# EAGLE design LPEM (EAGLE 9.4.1)

## Sheet 1 of 2
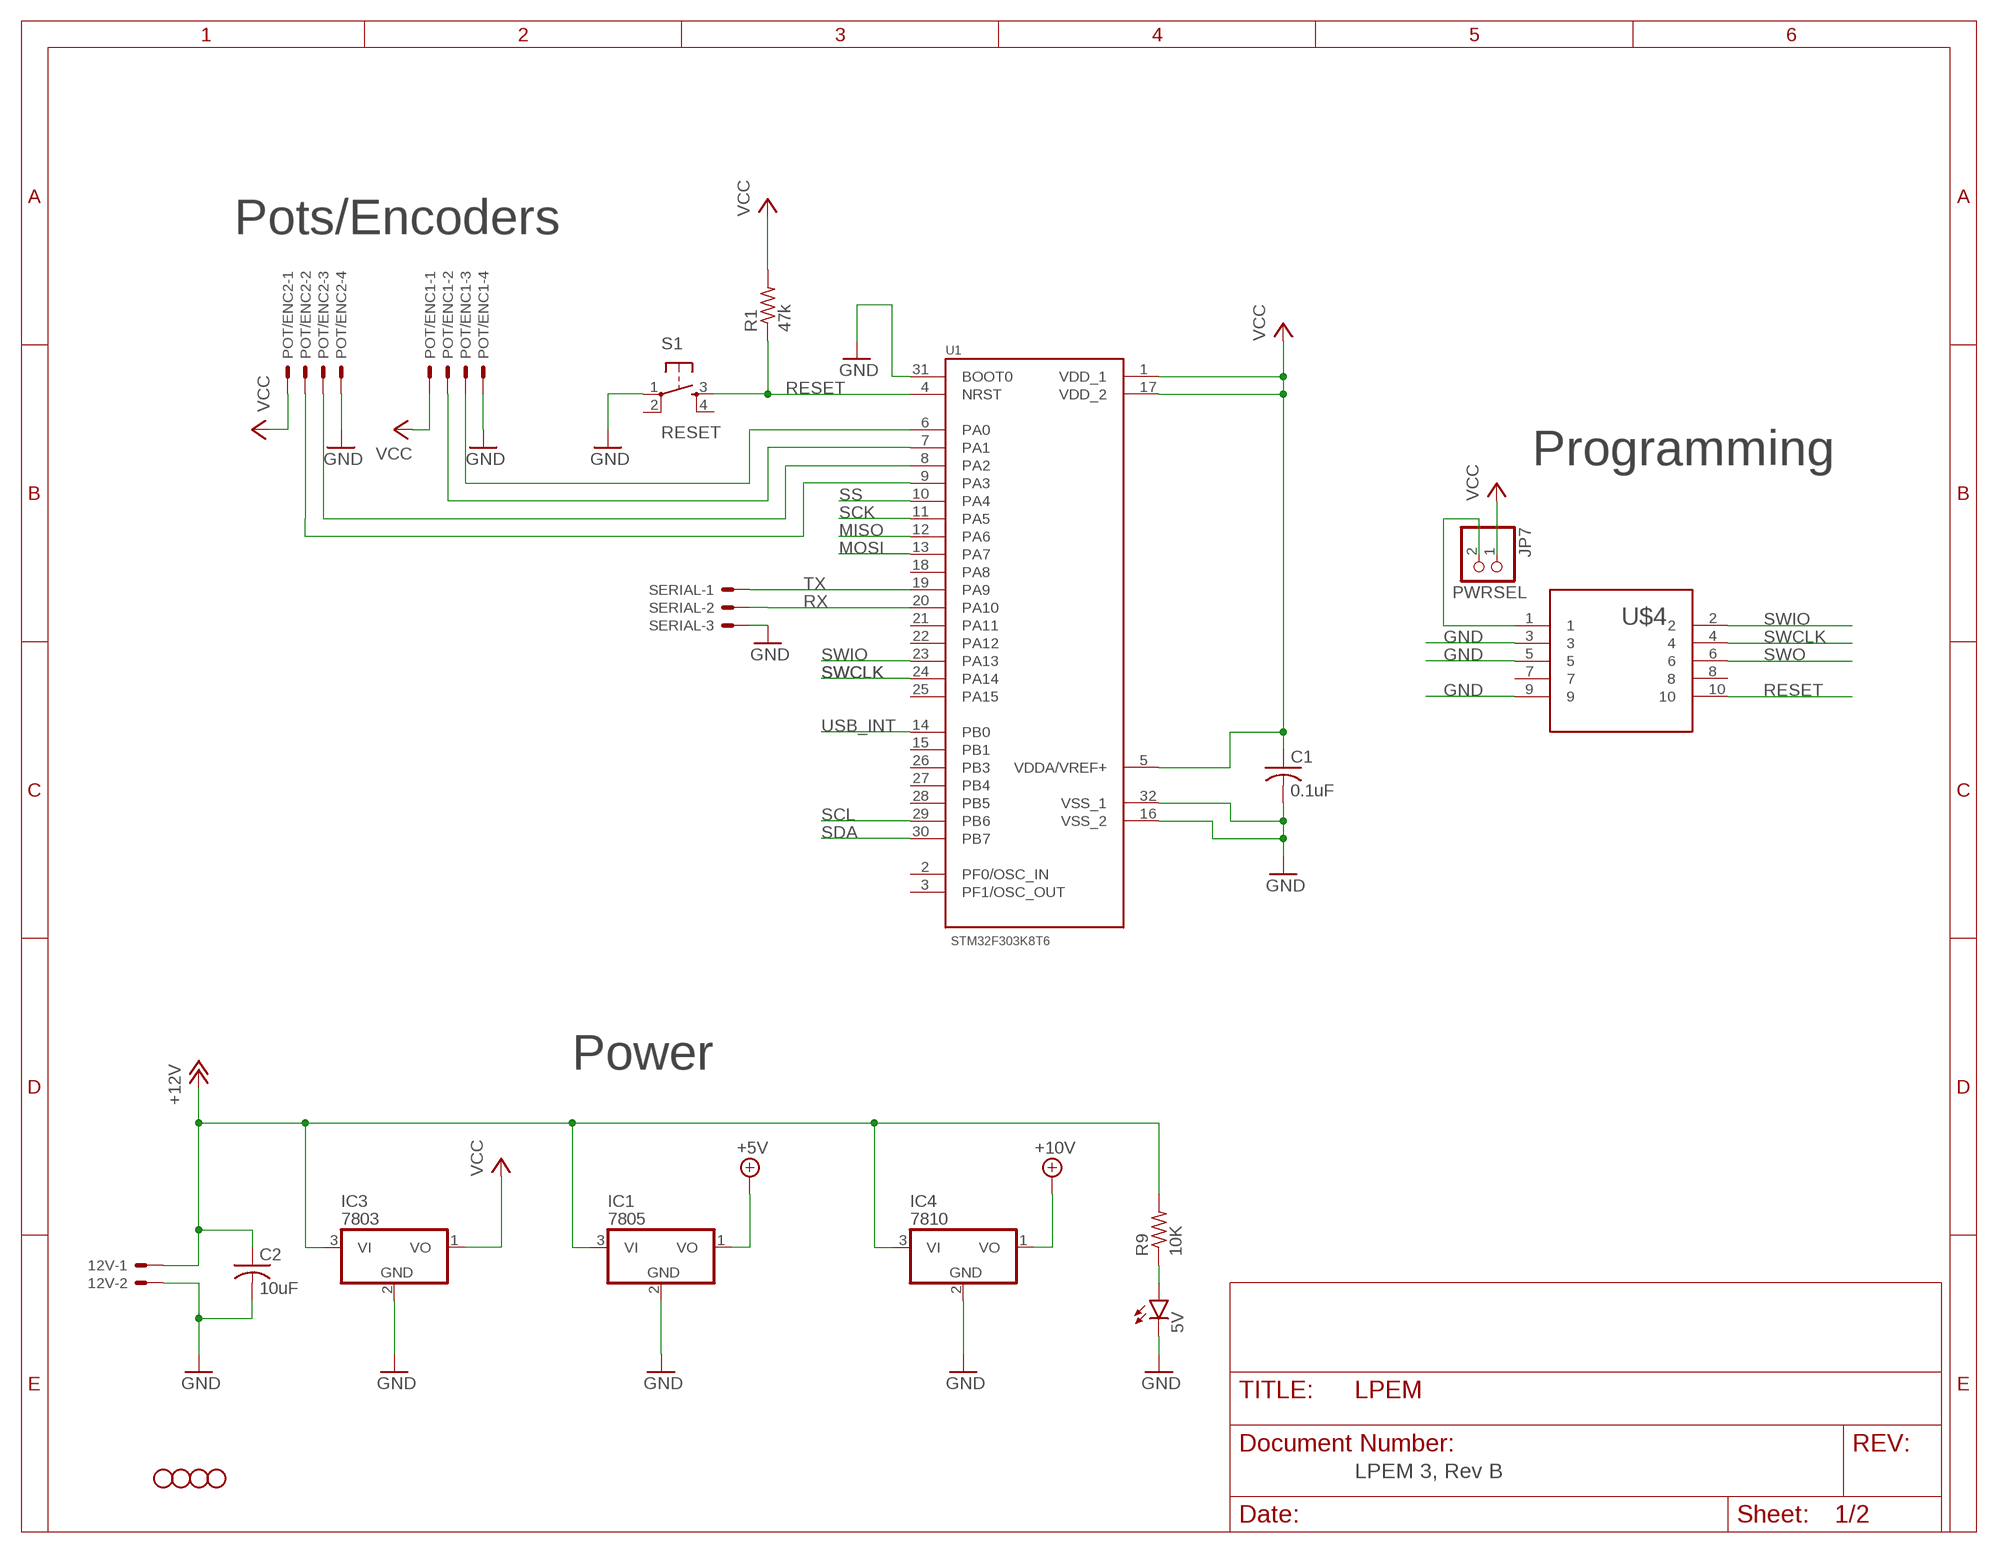
[diagram p0: schematic, sheet 1]

### Parts
5V  LED3MM  [LED3MM]
12V  22-23-2021  [22-23-2021]
C1  0.1uF  C-US025-025X050  [C025-025X050]
C2  10uF  C-US025-025X050  [C025-025X050]
IC1  7805  78L05Z  [TO92]
IC3  7803  78L05Z  [TO92]
IC4  7810  78L05Z  [TO92]
JP1  STAND-OFF  [STAND-OFF]
JP2  STAND-OFF  [STAND-OFF]
JP7  PWRSEL  PINHD-1X2  [1X02]
JP8  STAND-OFF  [STAND-OFF]
JP9  STAND-OFF  [STAND-OFF]
POT/ENC1  22-23-2041  [22-23-2041]
POT/ENC2  22-23-2041  [22-23-2041]
R1  47k  R-US_0204/5  [0204/5]
R9  10K  R-US_0204/5  [0204/5]
S1  RESET  TAC_SWITCHPTH  [TACTILE-PTH]
SERIAL  22-23-2031  [22-23-2031]
U1  STM32F303K8T6  [QFP80P900X900X160-32N]
U$4  CORTEX_HEADERJ  [CORTEX_HEADER]

### Nets
+5V [power]: IC1.1(VO) ; also sheet 2
+10V [power]: IC4.1(VO) ; also sheet 2
+12V [power]: 12V.1 C2.1 IC1.3(VI) IC3.3(VI) IC4.3(VI) R9.2 ; also sheet 2
GND [power]: 5V.K(C) 12V.2 C1.2 C2.2 IC1.2(GND) IC3.2(GND) IC4.2(GND) POT/ENC1.4 POT/ENC2.4 S1.1 SERIAL.3 U1.16(VSS_2) U1.31(BOOT0) U1.32(VSS_1) U$4.3 U$4.5 U$4.9 ; also sheet 2
MISO: U1.12(PA6) ; also sheet 2
MOSI: U1.13(PA7) ; also sheet 2
N$1: POT/ENC2.3 U1.8(PA2)
N$2: POT/ENC2.2 U1.9(PA3)
N$3: POT/ENC1.3 U1.6(PA0)
N$4 [power]: JP7.2 U$4.1
N$5: 5V.A R9.1
N$6: POT/ENC1.2 U1.7(PA1)
RESET: R1.1 S1.3 U1.4(NRST) U$4.10
RX: SERIAL.2 U1.20(PA10)
SCK: U1.11(PA5) ; also sheet 2
SCL: U1.29(PB6) ; also sheet 2
SDA: U1.30(PB7) ; also sheet 2
SS: U1.10(PA4) ; also sheet 2
SWCLK: U1.24(PA14) U$4.4
SWIO: U1.23(PA13) U$4.2
SWO: U$4.6
TX: SERIAL.1 U1.19(PA9)
USB_INT: U1.14(PB0) ; also sheet 2
VCC [power]: C1.1 IC3.1(VO) JP7.1 POT/ENC1.1 POT/ENC2.1 R1.2 U1.1(VDD_1) U1.5(VDDA/VREF+) U1.17(VDD_2) ; also sheet 2
Unconnected: S1.2 S1.4 U1.2(PF0/OSC_IN) U1.3(PF1/OSC_OUT) U1.15(PB1) U1.18(PA8) U1.21(PA11) U1.22(PA12) U1.25(PA15) U1.26(PB3) U1.27(PB4) U1.28(PB5) U$4.7 U$4.8

### Notes on the sheet
- Pots/Encoders
- Programming
- Power
- LPEM 3, Rev B

## Sheet 2 of 2
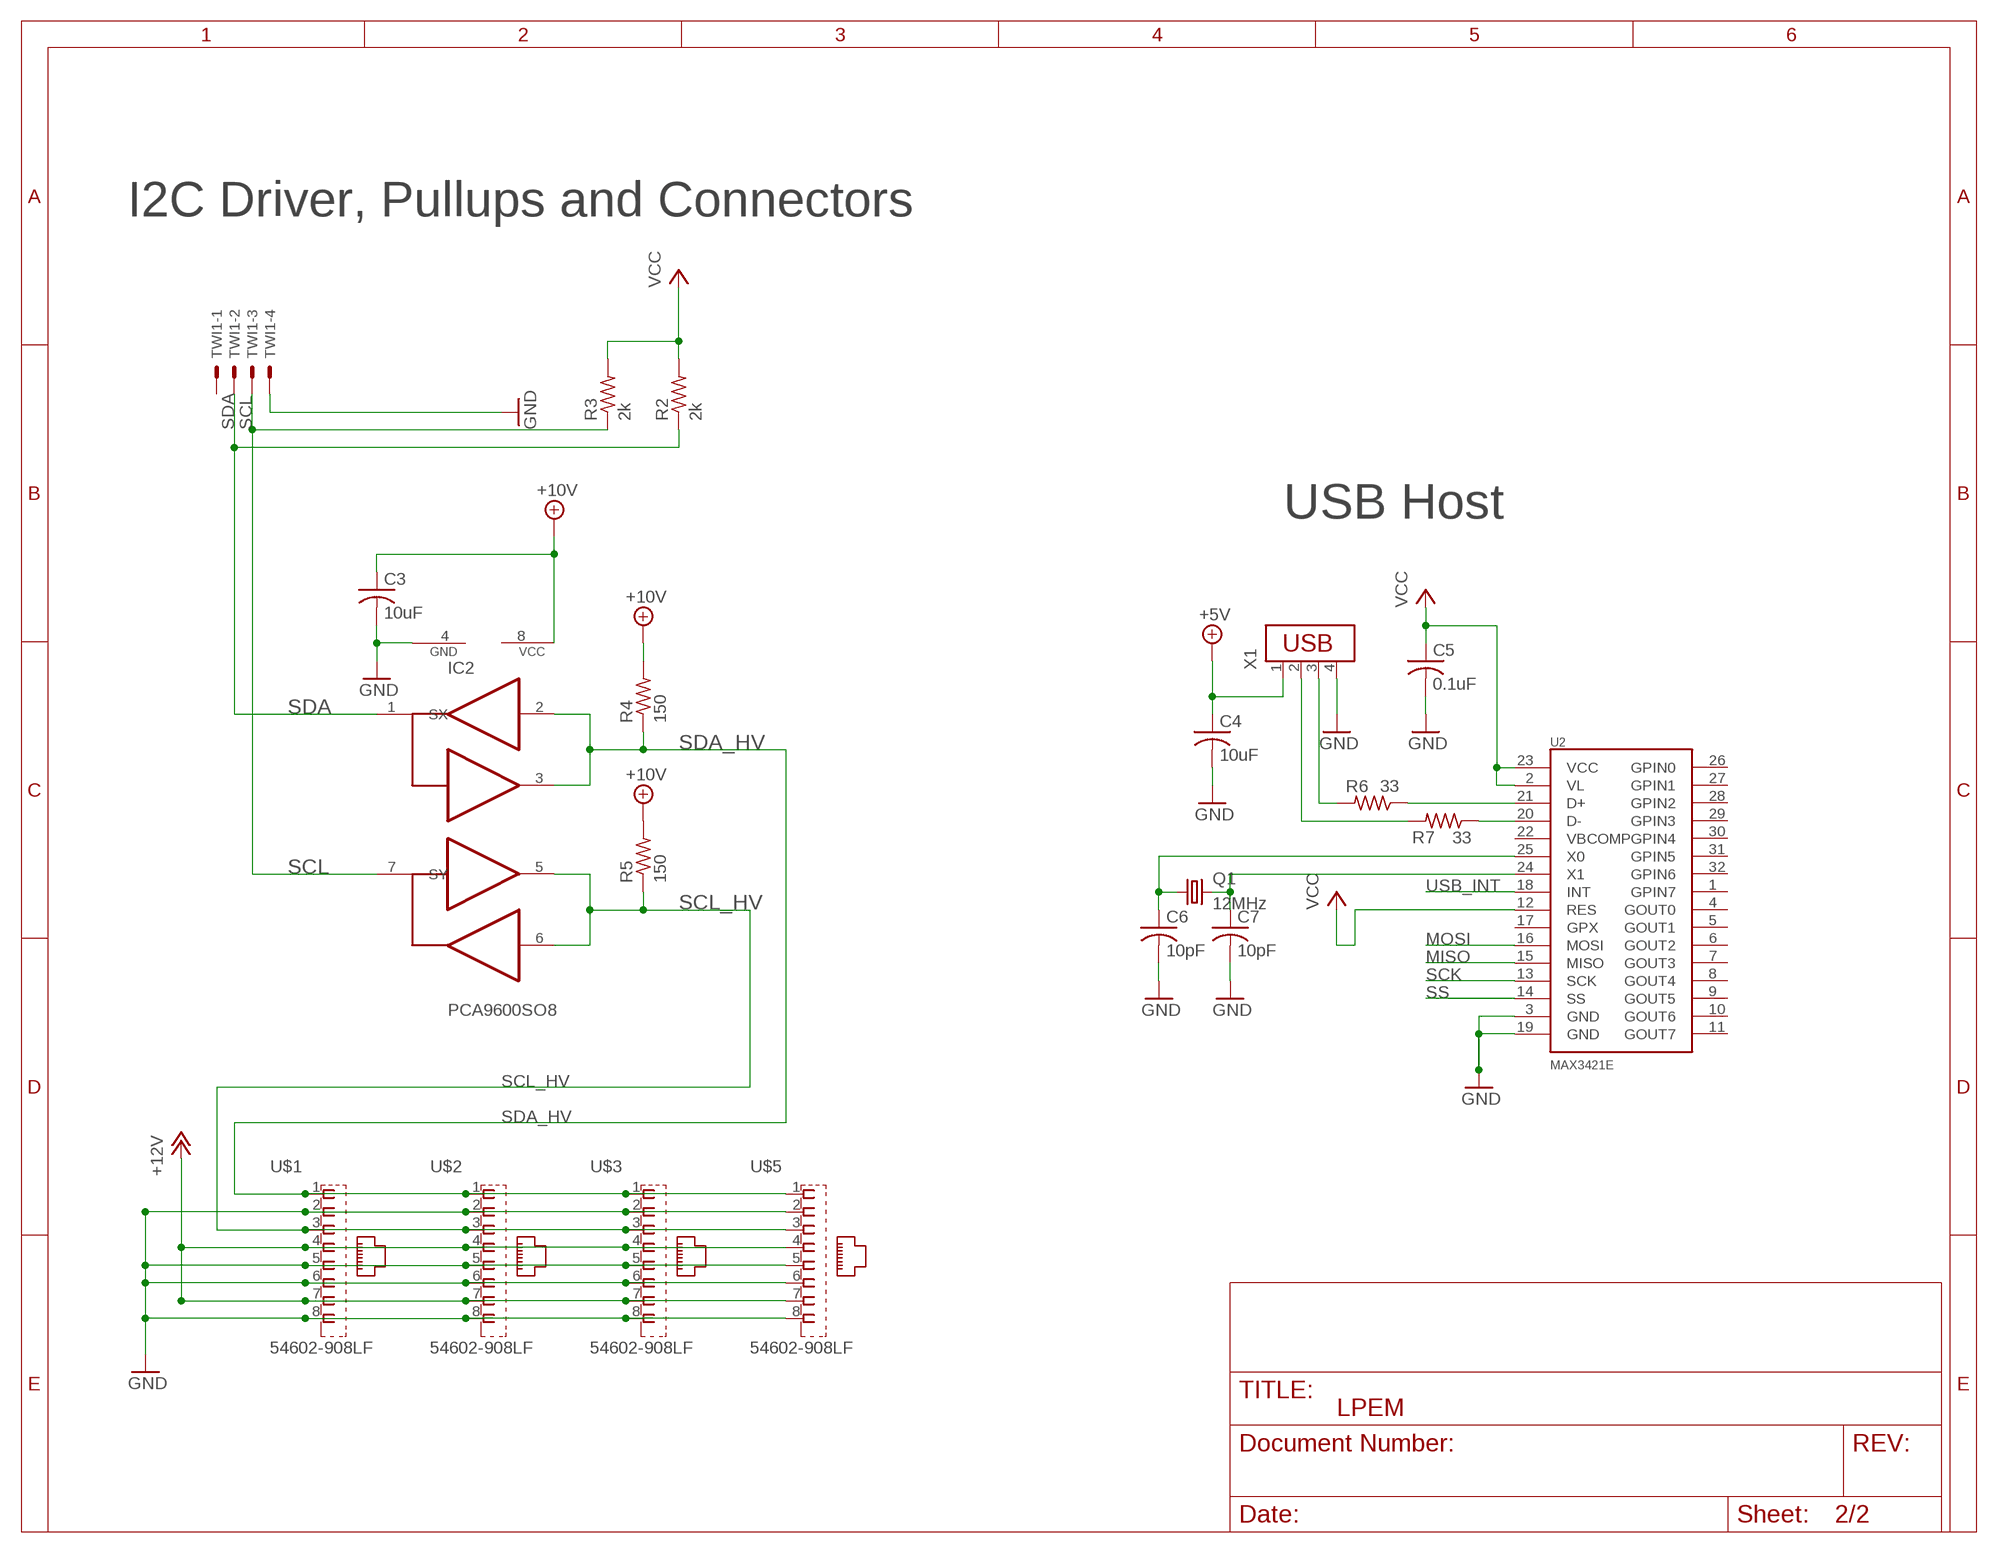
[diagram p1: schematic, sheet 2]

### Parts
C3  10uF  C-US025-025X050  [C025-025X050]
C4  10uF  C-US025-025X050  [C025-025X050]
C5  0.1uF  C-US025-025X050  [C025-025X050]
C6  10pF  C-US025-025X050  [C025-025X050]
C7  10pF  C-US025-025X050  [C025-025X050]
IC2  PCA9600SO8  [SO08]
Q1  12MHz  CRYSTALHC18U-V  [HC18U-V]
R2  2k  R-US_0204/5  [0204/5]
R3  2k  R-US_0204/5  [0204/5]
R4  150  R-US_0204/5  [0204/5]
R5  150  R-US_0204/5  [0204/5]
R6  33  R-US_0204/5  [0204/5]
R7  33  R-US_0204/5  [0204/5]
TWI1  22-23-2041  [22-23-2041]
U2  MAX3421E  [TQFP32-5MM]
U$1  54602-908LF  [AMPHENOL_54602-908LF]
U$2  54602-908LF  [AMPHENOL_54602-908LF]
U$3  54602-908LF  [AMPHENOL_54602-908LF]
U$5  54602-908LF  [AMPHENOL_54602-908LF]
X1  USB-787616  [USB]

### Nets
+5V [power]: C4.1 X1.1 ; also sheet 1
+10V [power]: C3.1 IC2.8(VCC) R4.2 R5.2 ; also sheet 1
+12V [power]: U$1.4 U$1.7 U$2.4 U$2.7 U$3.4 U$3.7 U$5.4 U$5.7 ; also sheet 1
GND [power]: C3.2 C4.2 C5.2 C6.2 C7.2 IC2.4(GND) TWI1.4 U2.3(GND) U2.19(GND) U$1.2 U$1.5 U$1.6 U$1.8 U$2.2 U$2.5 U$2.6 U$2.8 U$3.2 U$3.5 U$3.6 U$3.8 U$5.2 U$5.5 U$5.6 U$5.8 X1.4 ; also sheet 1
MISO: U2.15(MISO) ; also sheet 1
MOSI: U2.16(MOSI) ; also sheet 1
N$7: R6.2 X1.3
N$8: R7.2 X1.2
N$9: C6.1 Q1.1 U2.25(X0)
N$10: C7.1 Q1.2 U2.24(X1)
N$11: R6.1 U2.21(D+)
N$12: R7.1 U2.20(D-)
SCK: U2.13(SCK) ; also sheet 1
SCL: IC2.7(SY) R3.1 TWI1.3 ; also sheet 1
SCL_HV: IC2.5(TY) IC2.6(RY) R5.1 U$1.3 U$2.3 U$3.3 U$5.3
SDA: IC2.1(SX) R2.1 TWI1.2 ; also sheet 1
SDA_HV: IC2.2(RX) IC2.3(TX) R4.1 U$1.1 U$2.1 U$3.1 U$5.1
SS: U2.14(SS) ; also sheet 1
USB_INT: U2.18(INT) ; also sheet 1
VCC [power]: C5.1 R2.2 R3.2 U2.2(VL) U2.12(RES) U2.23(VCC) ; also sheet 1
Unconnected: TWI1.1 U2.1(GPIN7) U2.4(GOUT0) U2.5(GOUT1) U2.6(GOUT2) U2.7(GOUT3) U2.8(GOUT4) U2.9(GOUT5) U2.10(GOUT6) U2.11(GOUT7) U2.17(GPX) U2.22(VBCOMP) U2.26(GPIN0) U2.27(GPIN1) U2.28(GPIN2) U2.29(GPIN3) U2.30(GPIN4) U2.31(GPIN5) U2.32(GPIN6)

### Notes on the sheet
- I2C Driver, Pullups and Connectors
- USB Host

## Library data of the parts
5V = led:LED: LED OSRAM: - CHIPLED LG R971, LG N971, LY N971, LG Q971, LY Q971, LO R971, LY R971 LH N974, LH R974 LS Q976, LO Q976, LY Q976 LO Q996 - Hyper CHIPLED LW Q18S LB Q993, LB Q99A, LB R99A - SideLED LS A670, LO A670, LY A670, LG A670, LP A670 LB A673, LV A673, LT A673, LW A673 LH A674 LY A675 LS A676, LA A676, LO A676, LY A676, LW A676 LS A679, LY A679, LG A679 - Hyper Micro SIDELED® LS Y876, LA Y876, LO Y876, LY Y876 LT Y87S - SmartLED LW L88C, LW L88S LB L89C, LB L89S, LG L890 LS L89K, LO L89K, LY L89K LS L896, LA L896, LO L896, LY L896 - TOPLED LS T670, LO T670, LY T670, LG T670, LP T670 LSG T670, LSP T670, LSY T670, LOP T670, LYG T670 LG T671, LOG T671, LSG T671 LB T673, LV T673, LT T673, LW T673 LH T674 LS T676, LA T676, LO T676, LY T676, LB T676, LH T676, LSB T676, LW T676 LB T67C, LV T67C, LT T67C, LS T67K, LO T67K, LY T67K, LW E67C LS E67B, LA E67B, LO E67B, LY E67B, LB E67C, LV E67C, LT E67C LW T67C LS T679, LY T679, LG T679 LS T770, LO T770, LY T770, LG T770, LP T770 LB T773, LV T773, LT T773, LW T773 LH T774 LS E675, LA E675, LY E675, LS T675 LS T776, LA T776, LO T776, LY T776, LB T776 LHGB T686 LT T68C, LB T68C - Hyper Mini TOPLED® LB M676 - Mini TOPLED Santana® LG M470 LS M47K, LO M47K, LY M47K Source: http://www.osram.convergy.de LUXEON: - LUMILED® LXK2-PW12-R00, LXK2-PW12-S00, LXK2-PW14-U00, LXK2-PW14-V00 LXK2-PM12-R00, LXK2-PM12-S00, LXK2-PM14-U00 LXK2-PE12-Q00, LXK2-PE12-R00, LXK2-PE12-S00, LXK2-PE14-T00, LXK2-PE14-U00 LXK2-PB12-K00, LXK2-PB12-L00, LXK2-PB12-M00, LXK2-PB14-N00, LXK2-PB14-P00, LXK2-PB14-Q00 LXK2-PR12-L00, LXK2-PR12-M00, LXK2-PR14-Q00, LXK2-PR14-R00 LXK2-PD12-Q00, LXK2-PD12-R00, LXK2-PD12-S00 LXK2-PH12-R00, LXK2-PH12-S00 LXK2-PL12-P00, LXK2-PL12-Q00, LXK2-PL12-R00 Source: www.luxeon.com KINGBRIGHT: KA-3528ASYC Source: www.kingbright.com
12V = con-molex:22-23-2021: .100" (2.54mm) Center Header - 2 Pin; MF: MOLEX; MPN: 22-23-2021; OC_FARNELL: 1462926; OC_NEWARK: 25C3832
C1-C7 = rcl:C-US: CAPACITOR, American symbol; SPICEPREFIX: C
IC1 IC3 IC4 = linear:78*: Positive VOLTAGE REGULATOR Source: http://cache.national.com/ds/LM/LM78L05.pdf http://www.fairchildsemi.com/ds/LM/LM7805.pdf
IC2 = 4534_I2C2:PCA9600: I2C ACTIVE TERMINATOR SO-8
JP1 JP2 JP8 JP9 = SparkFun:STAND-OFF: Stand Off This is the mechanical footprint for a #4 phillips button head screw. Use the keepout ring to avoid running the screw head into surrounding components. SKU : PRT-00447
JP7 = pinhead:PINHD-1X2: PIN HEADER
POT/ENC1 POT/ENC2 TWI1 = con-molex:22-23-2041: .100" (2.54mm) Center Header - 4 Pin; MF: MOLEX; MPN: 22-23-2041; OC_FARNELL: 1462920; OC_NEWARK: 38C0355
Q1 = crystal:CRYSTAL: CRYSTAL; OC_FARNELL: unknown; OC_NEWARK: unknown
R1-R7 R9 = rcl:R-US_: RESISTOR, American symbol; SPICEPREFIX: R
S1 = SparkFun:TAC_SWITCH: Momentary Switch Button commonly used for reset or general input. Spark Fun Electronics SKU : COM-00097
SERIAL = con-molex:22-23-2031: .100" (2.54mm) Center Header - 3 Pin; MF: MOLEX; MPN: 22-23-2031; OC_FARNELL: 1462950; OC_NEWARK: 30C0862
U1 = STM32F303K8T6:STM32F303K8T6: Analog and DSP with FPU ARM Cortex-M4 MCU with 64 Kbytes Flash, 72 MHz CPU, CCM, 12-bit ADC 5 MSPS, comparators, op-amp; AVAILABILITY: Unavailable; DESCRIPTION: Analog and DSP with FPU ARM Cortex-M4 MCU with 64 Kbytes Flash, 72 MHz CPU, CCM, 12-bit ADC 5 MSPS, comparators, op-amp; MF: STMicroelectronics; MP: STM32F303K8T6; PACKAGE: LQFP-32 STMicroelectronics; PRICE: None
U2 = MAX3421E:MAX3421E: USB Peripheral/Host Controller with SPI Interface.; AVAILABILITY: Unavailable; DESCRIPTION: 1.2v To +5.5v, ±15kv Esd-Protected, 0.1µa, 35mbps, 8-Channel Level Translators; MF: Maxim Integrated; MP: MAX3421E; PACKAGE: None; PRICE: None
U$1-U$3 U$5 = 54602-908LF:54602-908LF: CONN MOD JACK 8P8C R/A UNSHLD; DESCRIPTION: Cat3 Rj45 Modular Jack, 8 Position, 1 Port; DIGI-KEY_PART_NUMBER: 609-1046-ND; DIGI-KEY_PURCHASE_URL: https://www.digikey.com/product-detail/en/amphenol-icc-fci/54602-908LF/609-1046-ND/1001360?utm_source=snapeda&utm_medium=aggregator&utm_campaign=symbol; MF: Amphenol ICC; MP: 54602-908LF; PACKAGE: None
U$4 = Lectrobox:CORTEX_HEADER; AVAILABILITY: Unavailable; DESCRIPTION: Conn Shrouded Header HDR 10 POS 1.27mm Solder ST Thru-Hole Tube; MF: Samtec Inc.; MP: TFM-105-01-S-D-WT; PACKAGE: None; PRICE: None
X1 = con-amp:USB-787616: AMP connector

## Net classes
0 default: width 0.152 mm, drill 0.152 mm, clearance 0.152 mm
1 power: width 0.305 mm, drill 0.305 mm, clearance 0.152 mm to class 0, clearance 0.152 mm

## Board
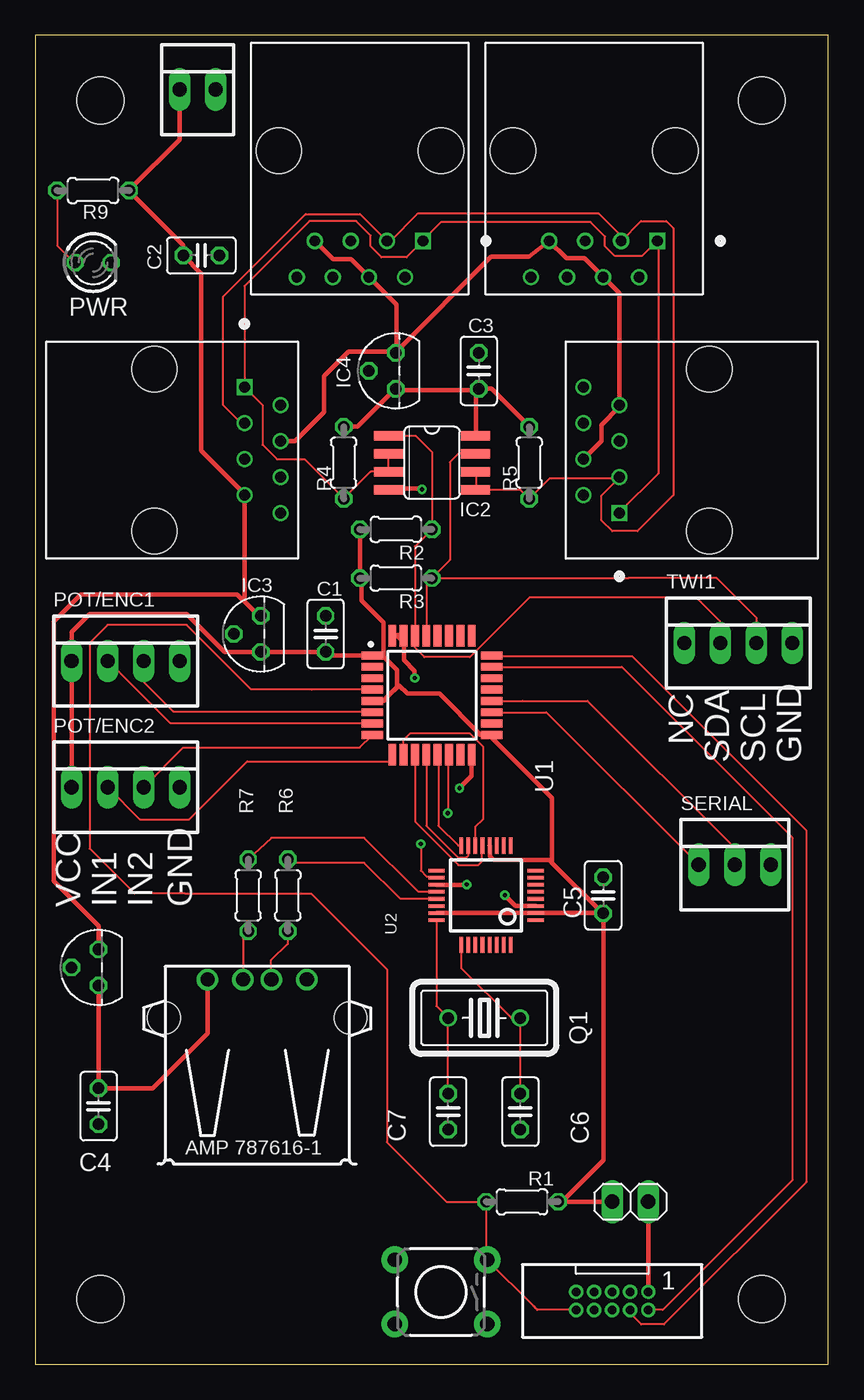
[diagram p2: board, top side]
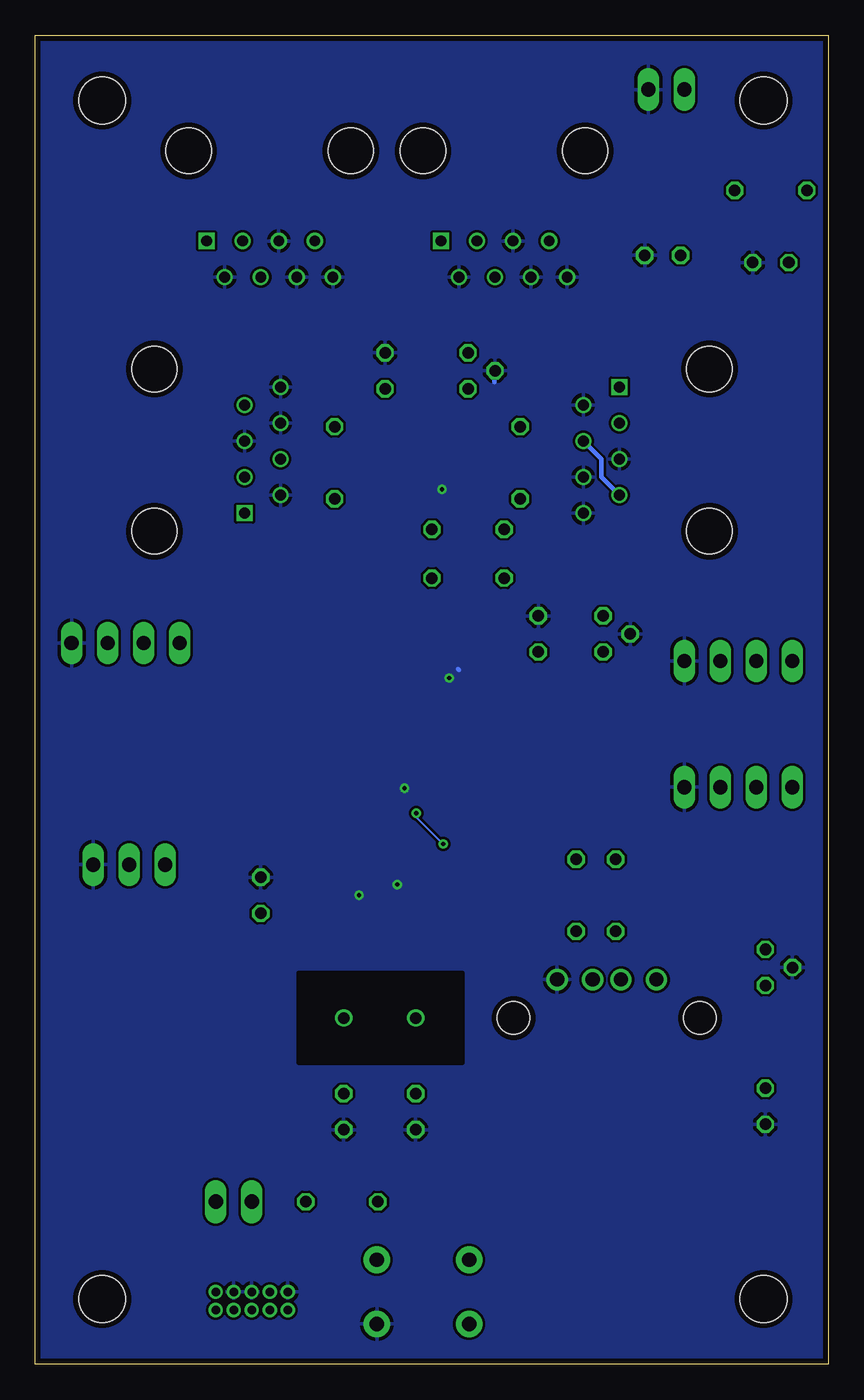
[diagram p3: board, bottom side, seen from below]

Size 55.88 x 93.6 mm. Coordinates in mm from the lower left corner, seen from the top.
Outline: 0,0 55.88,0 55.88,93.6 0,93.6 0,0
Copper layers (1*16): Top 0.0356mm / dielectric 1.5011mm / Bottom 0.0356mm
Design rules "DorkbotPDX *": minimum track width 6mil, minimum drill 12mil, track to track 7mil, track to pad 7mil, pad to pad 7mil, via to via 7mil, smd to smd 6mil, copper to edge 15mil, drill to drill 15mil, minimum pad ring 7mil, minimum via ring 7mil, stop-mask expansion 4mil, vias tented up to drill 13mil, thermal gap 10mil
bRestrict: area 25.8,21.2 to 37.3,27.6

### Footprints (pad centres in the part's own frame; a part is rotated, then mirrored left to right if it is on the bottom)
LED3MM = drill 0.813 octagon: A -1.27,0; K 1.27,0
22-23-2021 = drill 1 long: 1 -1.27,0; 2 1.27,0
C025-025X050 = drill 0.813 octagon: 1 -1.27,0; 2 1.27,0
TO92 = drill 0.813 octagon: 1 -1.27,0; 2 0,1.905; 3 1.27,0
SO08 = smd 0.66 x 2.032: 1 -1.905,-3.073; 2 -0.635,-3.073; 3 0.635,-3.073; 4 1.905,-3.073; 5 1.905,3.073; 6 0.635,3.073; 7 -0.635,3.073; 8 -1.905,3.073
STAND-OFF = hole 3.302: 0,0
1X02 = drill 1.016 long: 1 -1.27,0; 2 1.27,0
22-23-2041 = drill 1 long: 1 -3.81,0; 2 -1.27,0; 3 1.27,0; 4 3.81,0
HC18U-V = drill 0.813: 1 -2.54,0; 2 2.54,0
0204/5 = drill 0.813 octagon: 1 -2.54,0; 2 2.54,0
TACTILE-PTH = drill 1.016 pad 1.88: 1 -3.251,2.261; 2 3.251,2.261; 3 -3.251,-2.261; 4 3.251,-2.261
22-23-2031 = drill 1 long: 1 -2.54,0; 2 0,0; 3 2.54,0
QFP80P900X900X160-32N = smd 1.5 x 0.55: 1 -4.2,2.8; 2 -4.2,2; 3 -4.2,1.2; 4 -4.2,0.4; 5 -4.2,-0.4; 6 -4.2,-1.2; 7 -4.2,-2; 8 -4.2,-2.8; 17 4.2,-2.8; 18 4.2,-2; 19 4.2,-1.2; 20 4.2,-0.4; 21 4.2,0.4; 22 4.2,1.2; 23 4.2,2; 24 4.2,2.8 | smd 0.55 x 1.5: 9 -2.8,-4.2; 10 -2,-4.2; 11 -1.2,-4.2; 12 -0.4,-4.2; 13 0.4,-4.2; 14 1.2,-4.2; 15 2,-4.2; 16 2.8,-4.2; 25 2.8,4.2; 26 2,4.2; 27 1.2,4.2; 28 0.4,4.2; 29 -0.4,4.2; 30 -1.2,4.2; 31 -2,4.2; 32 -2.8,4.2
TQFP32-5MM = smd 1.143 x 0.254: 1 -3.5,1.75; 2 -3.5,1.25; 3 -3.5,0.75; 4 -3.5,0.25; 5 -3.5,-0.25; 6 -3.5,-0.75; 7 -3.5,-1.25; 8 -3.5,-1.75; 17 3.5,-1.75; 18 3.5,-1.25; 19 3.5,-0.75; 20 3.5,-0.25; 21 3.5,0.25; 22 3.5,0.75; 23 3.5,1.25; 24 3.5,1.75 | smd 0.254 x 1.143: 9 -1.75,-3.5; 10 -1.25,-3.5; 11 -0.75,-3.5; 12 -0.25,-3.5; 13 0.25,-3.5; 14 0.75,-3.5; 15 1.25,-3.5; 16 1.75,-3.5; 25 1.75,3.5; 26 1.25,3.5; 27 0.75,3.5; 28 0.25,3.5; 29 -0.25,3.5; 30 -0.75,3.5; 31 -1.25,3.5; 32 -1.75,3.5
AMPHENOL_54602-908LF = drill 0.76 square: 1 -4.445,6.35 | drill 0.76: 2 -3.175,8.89; 3 -1.905,6.35; 4 -0.635,8.89; 5 0.635,6.35; 6 1.905,8.89; 7 3.175,6.35; 8 4.445,8.89 | hole 3.2: -5.715,0; 5.715,0
CORTEX_HEADER = drill 0.6 pad 1: 1 -2.54,-0.635; 2 -2.54,0.635; 3 -1.27,-0.635; 4 -1.27,0.635; 5 0,-0.635; 6 0,0.635; 7 1.27,-0.635; 8 1.27,0.635; 9 2.54,-0.635; 10 2.54,0.635
USB = drill 1: 1 -3.5,12.99; 2 -1,12.99; 3 1,12.99; 4 3.5,12.99 | hole 2.3: -6.57,10.28; 6.57,10.28

### Placement (x,y rotation side)
5V  4.06,77.6 0 top
12V  11.43,89.79 0 top
C1  20.45,51.44 90 top
C2  11.68,78.11 0 top
C3  31.24,69.98 90 top
C4  4.45,18.16 270 top
C5  40.01,33.02 90 top
C6  34.16,17.78 270 top
C7  29.08,17.78 270 top
IC1  4.45,27.94 90 top
IC2  27.94,63.5 270 top
IC3  15.88,51.44 90 top
IC4  25.4,69.98 90 top
JP1  4.57,89.03 0 top
JP2  51.18,89.03 0 top
JP7  41.91,11.43 0 top
JP8  4.57,4.57 0 top
JP9  51.18,4.57 0 top
POT/ENC1  6.35,49.53 0 top
POT/ENC2  6.35,40.64 0 top
Q1  31.62,24.38 180 top
R1  34.29,11.43 0 top
R2  25.4,58.8 180 top
R3  25.4,55.37 180 top
R4  21.72,63.5 90 top
R5  34.8,63.5 90 top
R6  17.78,33.02 270 top
R7  14.99,33.02 270 top
R9  4.06,82.68 0 top
S1  28.57,5.08 180 top
SERIAL  49.28,35.18 0 top
TWI1  49.53,50.8 0 top
U1  27.94,47.12 0 top
U2  31.75,33.02 180 top
U$1  47.5,64.39 90 top
U$2  39.37,85.47 180 top
U$3  22.86,85.47 180 top
U$4  40.64,4.45 180 top
U$5  8.38,64.39 270 top
X1  15.62,14.1 0 top

### Tracks (layer width: path | path; a pad name or v marks a point on that pad's centre or on a via)
+5V
  Top 0.305: IC1.1 C4.1 8.28,19.43 12.12,23.28 X1.1
+10V
  Top 0.305: R4.2 22.7,66.04 25.34,68.68 IC4.1 25.51,68.6 30.96,68.6 C3.1 | IC2.8 31.04,65.46 31.04,68.52 31.2,68.68 C3.1 | C3.1 32.13,68.71 R5.2
+12V
  Top 0.305: 12V.1 10.15,89.76 10.15,86.27 6.69,82.8 R9.2 6.6,82.63 10.41,78.83 C2.1 11.68,76.83 11.68,64.34 14.78,61.25 U$5.7 14.73,53.72 14.99,53.47 | 25.43,71.32 32.11,78.01 34.79,78.01 U$2.7 37.41,77.9 38.68,77.9 U$2.4 41.15,75.44 U$1.7 41.15,67.44 39.88,66.17 39.88,65.02 U$1.4 | 25.43,71.32 IC4.3 | IC3.3 15.75,52.7 14.99,53.47 | IC1.3 4.45,30.86 1.27,34.04 1.27,52.32 3.17,54.23 14.22,54.23 14.99,53.47 | 25.43,71.32 25.43,74.65 U$3.4 22.23,77.85 20.95,77.85 U$3.7 | U$5.4 18.29,65.02 20.32,67.06 20.32,69.6 22.05,71.32 25.43,71.32
  Bottom 0.305: U$5.7 16,62.48 16,63.75 U$5.4
GND  (via drill 0.3)
  Top 0.305: 25.45,51.35 25.92,51.35 U1.31 | 25.45,51.35 25.4,51.35 25.18,51.35 U1.32 | 25.45,51.35 25.96,50.84 25.96,49.6 26.73,48.84 v26.73,48.33 | v27.23,61.61 27.18,61.66 24.93,61.66 IC2.4 | U1.16 30.74,41.43 v29.88,40.57 | U2.3 33.83,32.27 v33.08,33.02 | v30.4,33.78 30.38,33.77 U2.19
  Bottom 0.305: 23.53,69.18 23.53,69.92 IC4.2 | 26.09,48.95 26.04,48.9
  pour Bottom: 0,93.98 55.88,93.98 55.88,0 0,-0.36
MISO
  Top 0.152: U1.12 27.54,37.92 29.77,35.69 30.36,35.69 30.5,35.84 U2.15
MOSI
  Top 0.152: U2.16 29.79,36.52 28.4,37.92 28.4,42.84 U1.13
N$1
  Top 0.152: U1.8 23.69,44.25 23.67,44.25 22.84,43.42 10.4,43.42 7.68,40.7 POT/ENC2.3
N$2
  Top 0.152: U1.9 25.14,42.5 25.12,42.46 14.92,42.46 10.83,38.37 7.36,38.37 5.12,40.62 POT/ENC2.2
N$3
  Top 0.152: POT/ENC1.3 7.62,48.06 9.7,45.98 23.69,45.98 U1.6
N$4
  Top 0.305: JP7.2 U$4.1
N$5
  Top 0.152: R9.1 1.57,82.63 1.57,78.75 2.72,77.6 5V.A
N$6
  Top 0.152: U1.7 23.69,45.16 9.49,45.16 5.12,49.53 POT/ENC1.2
N$7
  Top 0.152: R6.2 17.78,29.59 16.62,28.48 X1.3
N$8
  Top 0.152: R7.2 14.62,29.99 X1.2
N$9
  Top 0.152: C6.1 Q1.1 33.53,24.38 30,27.91 U2.25
N$10
  Top 0.152: C7.1 Q1.2 28.25,25.22 U2.24
N$11
  Top 0.152: U2.21 25.71,32.77 23.17,35.31 17.78,35.31 R6.1
N$12
  Top 0.152: U2.20 26.98,33.27 23.17,37.08 16.63,37.08 R7.1
RESET
  Top 0.152: U1.4 19.48,47.52 19.47,47.54 15.2,47.54 10.67,52.07 5.08,52.07 3.81,50.8 3.81,36.32 6.99,33.15 10.54,33.15 19.43,33.15 24.77,27.81 24.77,15.62 28.96,11.43 R1.1 31.75,7.42 S1.3 35.08,4.09 35.25,3.92 35.36,3.81 U$4.10
RX
  Top 0.152: U1.20 34.35,46.72 | 34.35,46.72 | 34.35,46.72 38.91,46.72 49.28,36.35 SERIAL.2
SCK
  Top 0.152: U2.13 31.45,36.49 31.45,35.4 31.2,35.15 29.8,35.15 26.75,38.21 26.75,42.84 U1.11
SCL
  Top 0.152: U1.29 27.57,51.35 27.57,51.56 27.57,55 R3.1 | IC2.7 29.81,64.14 29.21,63.53 29.21,56.64 R3.1 | R3.1 41.78,55.37 48.01,55.37 50.8,52.58 TWI1.3
SCL_HV
  Top 0.152: U$5.3 14.49,66.29 13.23,67.55 13.23,75.21 19.05,81.03 22.86,81.03 U$3.3 25.01,79.12 26.92,81.03 39.69,81.03 41.27,79.44 U$2.3 42.67,80.52 44.45,80.52 44.96,80.01 44.96,61.21 42.42,58.67 40.64,58.67 39.88,59.44 39.88,61.18 41.11,62.41 | IC2.6 31.04,62.82 31.04,61.66 IC2.5 31.04,61.58 34.18,61.58 R5.1 34.84,61 36.24,62.41 41.11,62.41 | 41.11,62.41 U$1.3
SDA
  Top 0.152: IC2.1 26.8,65.41 27.94,64.26 R2.1 26.74,57.6 U1.30 26.76,51.3 26.76,50.46 27.41,49.8 30.61,49.8 34.83,54.02 46.57,54.02 48.26,52.32 TWI1.2
SDA_HV
  Top 0.152: U$1.1 41.19,60.01 41.19,60.06 43.88,62.75 43.88,78.87 43.75,78.99 43.69,78.99 | 21.72,61 18.96,63.75 17.02,63.75 16,64.77 16,67.56 U$5.1 14.73,75.95 19.3,80.52 22.61,80.52 23.62,79.5 23.62,78.74 24.38,77.98 26.16,77.98 U$3.1 27.56,79.38 27.57,79.44 28.58,80.45 39.11,80.45 40.13,79.42 40.13,78.74 40.8,78.07 42.77,78.07 43.69,78.99 | 21.72,61 R4.1 | 21.72,61 21.75,61 23.62,62.87 IC2.3 24.85,62.9 24.85,64.06 24.87,64.08 IC2.2 | U$2.1 43.69,78.99
SS
  Top 0.152: U2.14 31.04,36.57 30.99,36.62 30.99,37.85 31.52,38.38 31.52,43.52 30.59,44.45 26.42,44.45 25.94,43.97 U1.10
SWCLK
  Top 0.152: U1.24 32.19,49.86 42.05,49.86 54.3,37.6 54.3,12.82 44.28,2.79 42.69,2.79 41.91,3.57 U$4.4
SWIO
  Top 0.152: U1.23 41.31,49.12 53.34,37.08 53.34,12.95 44.2,3.81 U$4.2
TX
  Top 0.152: SERIAL.1 36,45.92 U1.19
USB_INT  (via drill 0.3)
  Top 0.152: v27.15,36.64 27.15,34.76 27.57,34.34 28.23,34.34 U2.18 | v29.06,38.8 29.06,42.84 U1.14
  Bottom 0.152: v29.06,38.8 29.06,38.54 v27.15,36.64
VCC
  Top 0.305: 36.48,35.25 36.41,35.31 36.41,39.87 32.11,44.16 U1.17 32.11,44.33 31.36,44.33 28.46,47.23 26.2,47.23 25.61,47.82 24.85,47.05 | U2.12 32.03,36.49 32.03,35.74 32.27,35.5 36.22,35.5 36.48,35.25 | POT/ENC2.1 2.56,40.7 2.56,49.53 POT/ENC1.1 2.54,51.56 3.81,52.83 10.67,52.83 13.34,50.16 IC3.1 20.32,50.16 | 24.85,47.05 25.48,47.69 25.48,48.9 24.52,49.86 | 24.85,47.05 24.52,46.72 23.77,46.72 U1.5 | 24.52,49.86 24.52,52.25 22.99,53.78 22.99,55.24 R3.2 R2.2 | R1.2 37.08,11.43 | 37.08,11.43 JP7.1 | 20.32,50.16 C1.1 | 37.08,11.43 40.01,14.35 C5.1 39.98,31.75 39.95,31.77 | U2.23 U2.2 39.95,31.77 | 36.48,35.25 39.95,31.77 | 20.32,50.16 20.57,49.92 U1.1 24.46,49.92 24.52,49.86

### Text on the board
tNames: PWR | NC | SDA | SCL | GND | VCC | IN1 | IN2 | GND
tDocu: 12V | GND | TX | RX | GND | LPEM v3.3 / July 2019 | RESET